# Altium schematic sheet Top.SchDoc
size A2; SheetNumber: 1; SheetTotal: 3
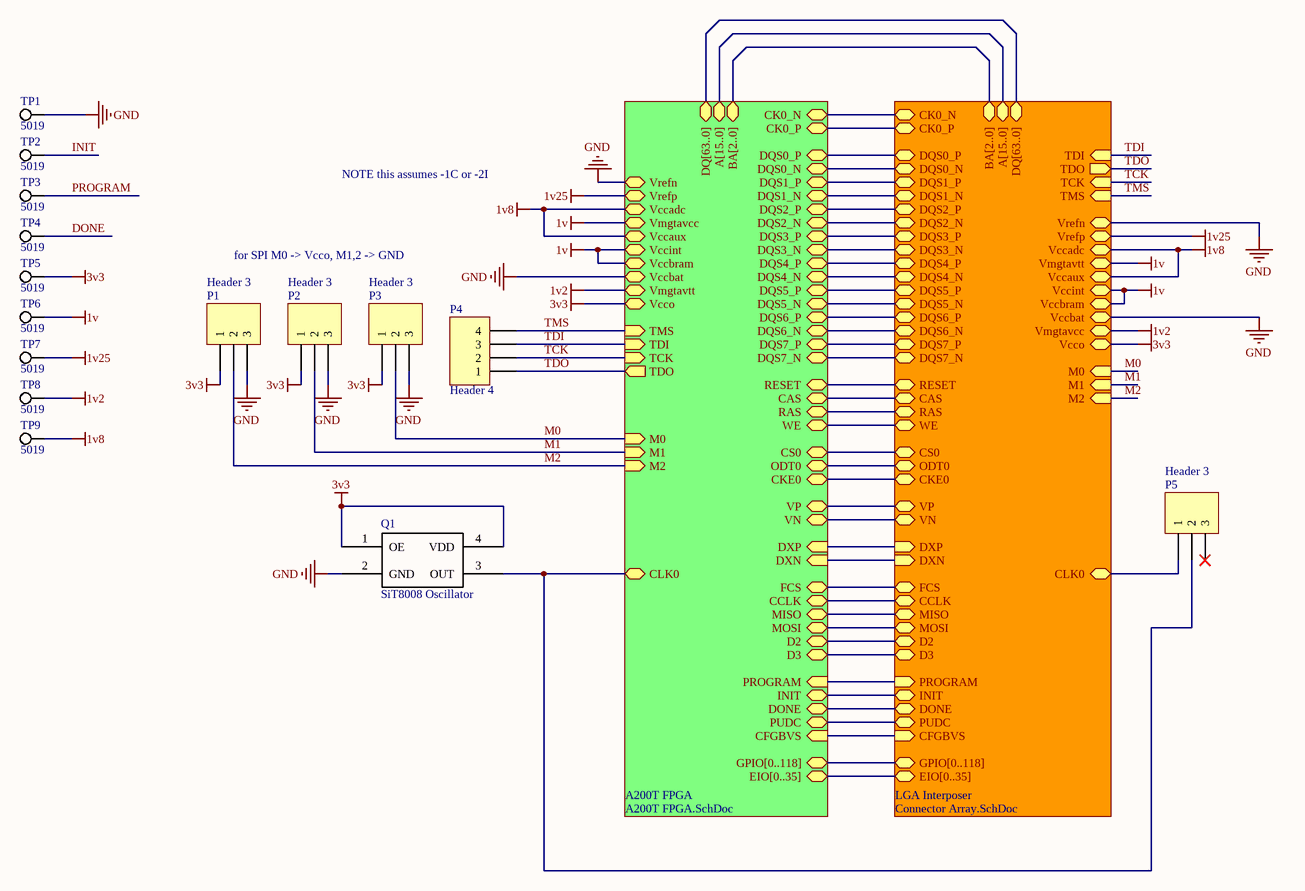
[diagram p0: Top.SchDoc]

## Parts
P1  Header 3  [HDR1X3]
P2  Header 3  [HDR1X3]
P3  Header 3  [HDR1X3]
P4  Header 4  [HDR1X4]
P5  Header 3  [HDR1X3]
Q1  SiT8008 Oscillator  [SiT8008 2.5x2]
TP1  5019  [KSTN-5019_V]
TP2  5019  [KSTN-5019_V]
TP3  5019  [KSTN-5019_V]
TP4  5019  [KSTN-5019_V]
TP5  5019  [KSTN-5019_V]
TP6  5019  [KSTN-5019_V]
TP7  5019  [KSTN-5019_V]
TP8  5019  [KSTN-5019_V]
TP9  5019  [KSTN-5019_V]

## Sub-sheets
A200T FPGA = A200T FPGA.SchDoc: BA[2..0] (bidir), A[15..0] (bidir), DQS1_P (bidir), DQS2_N (bidir), DQS7_N (bidir), DQS0_P (bidir), DQS6_N (bidir), DQS6_P (bidir), DQS1_N (bidir), DQS7_P (bidir), DQS4_P (bidir), DQS5_N (bidir), DQS3_P (bidir), DQS0_N (bidir), DQS2_P (bidir), DQS3_N (bidir), DQS4_N (bidir), DQS5_P (bidir), RAS (bidir), RESET (bidir), WE (bidir), CAS (bidir), CK0_P (bidir), CK0_N (bidir), ODT0 (bidir), CS0 (bidir), CKE0 (bidir), Vrefp (bidir), Vccadc (bidir), Vmgtavcc (bidir), Vccaux (bidir), Vccint (bidir), Vccbram (bidir), Vccbat (bidir), Vmgtavtt (bidir), Vcco (bidir), DQ[63..0] (bidir), Vrefn (bidir), PUDC (bidir), FCS (bidir), CCLK (bidir), INIT (bidir), MISO (bidir), DONE (bidir), MOSI (bidir), D2 (bidir), D3 (bidir), CLK0 (bidir), VP (bidir), VN (bidir), EIO[0..35] (bidir), GPIO[0..118] (bidir), TDO (out), CFGBVS (in), TMS (in), TCK (in), PROGRAM (in), TDI (in), DXP (in), M2 (in), M0 (in), DXN (in), M1 (in)
LGA Interposer = Connector Array.SchDoc: DQS0_P (bidir), DQS0_N (bidir), DQS1_P (bidir), DQS1_N (bidir), DQS2_P (bidir), DQS2_N (bidir), DQS3_P (bidir), DQS3_N (bidir), DQS4_P (bidir), DQS4_N (bidir), DQS5_P (bidir), DQS5_N (bidir), DQS6_P (bidir), DQS6_N (bidir), DQS7_P (bidir), DQS7_N (bidir), DQ[63..0] (bidir), A[15..0] (bidir), BA[2..0] (bidir), CK0_N (bidir), CK0_P (bidir), RAS (bidir), CAS (bidir), WE (bidir), RESET (bidir), CKE0 (bidir), ODT0 (bidir), CS0 (bidir), TDI (in), TDO (out), TCK (in), TMS (in), DXP (in), DXN (in), CLK0 (bidir), M0 (in), CCLK (bidir), M1 (in), M2 (in), DONE (bidir), INIT (bidir), PROGRAM (in), CFGBVS (in), MOSI (bidir), MISO (bidir), PUDC (bidir), FCS (bidir), D2 (bidir), D3 (bidir), Vccint (bidir), Vccaux (bidir), Vccbram (bidir), Vcco (bidir), Vccbat (bidir), Vmgtavcc (bidir), Vmgtavtt (bidir), Vccadc (bidir), Vrefp (bidir), Vrefn (bidir), EIO[0..35] (bidir), GPIO[0..118] (bidir), VP (bidir), VN (bidir)

## Nets
1v: TP6.1 ; sheet A200T FPGA/Vmgtavcc, sheet A200T FPGA/Vccint, sheet A200T FPGA/Vccbram, sheet LGA Interposer/Vccint, sheet LGA Interposer/Vccbram, sheet LGA Interposer/Vmgtavtt
1v2: TP8.1 ; sheet A200T FPGA/Vmgtavtt, sheet LGA Interposer/Vmgtavcc
1v8: TP9.1 ; sheet A200T FPGA/Vccadc, sheet A200T FPGA/Vccaux, sheet LGA Interposer/Vccaux, sheet LGA Interposer/Vccadc
1v25: TP7.1 ; sheet A200T FPGA/Vrefp, sheet LGA Interposer/Vrefp
3v3: P1.1 P2.1 P3.1 Q1.1(OE) Q1.4(VDD) TP5.1 ; sheet A200T FPGA/Vcco, sheet LGA Interposer/Vcco
GND: P1.3 P2.3 P3.3 Q1.2(GND) TP1.1 ; sheet A200T FPGA/Vccbat, sheet A200T FPGA/Vrefn, sheet LGA Interposer/Vccbat, sheet LGA Interposer/Vrefn
DONE: TP4.1
INIT: TP2.1
M0: P3.2 ; sheet A200T FPGA/M0, sheet LGA Interposer/M0
M1: P2.2 ; sheet A200T FPGA/M1, sheet LGA Interposer/M1
M2: P1.2 ; sheet A200T FPGA/M2, sheet LGA Interposer/M2
PROGRAM: TP3.1
TCK: P4.2 ; sheet A200T FPGA/TCK, sheet LGA Interposer/TCK
TDI: P4.3 ; sheet A200T FPGA/TDI, sheet LGA Interposer/TDI
TDO: P4.1 ; sheet A200T FPGA/TDO, sheet LGA Interposer/TDO
TMS: P4.4 ; sheet A200T FPGA/TMS, sheet LGA Interposer/TMS
NetP5_1: P5.1 ; sheet LGA Interposer/CLK0
NetP5_2: P5.2 Q1.3(OUT) ; sheet A200T FPGA/CLK0
(unnamed): sheet A200T FPGA/DQS1_P, sheet LGA Interposer/DQS1_P
(unnamed): sheet A200T FPGA/DQS2_N, sheet LGA Interposer/DQS2_N
(unnamed): sheet A200T FPGA/DQS7_N, sheet LGA Interposer/DQS7_N
(unnamed): sheet A200T FPGA/DQS0_P, sheet LGA Interposer/DQS0_P
(unnamed): sheet A200T FPGA/DQS6_N, sheet LGA Interposer/DQS6_N
(unnamed): sheet A200T FPGA/DQS6_P, sheet LGA Interposer/DQS6_P
(unnamed): sheet A200T FPGA/DQS1_N, sheet LGA Interposer/DQS1_N
(unnamed): sheet A200T FPGA/DQS7_P, sheet LGA Interposer/DQS7_P
(unnamed): sheet A200T FPGA/DQS4_P, sheet LGA Interposer/DQS4_P
(unnamed): sheet A200T FPGA/DQS5_N, sheet LGA Interposer/DQS5_N
(unnamed): sheet A200T FPGA/DQS3_P, sheet LGA Interposer/DQS3_P
(unnamed): sheet A200T FPGA/DQS0_N, sheet LGA Interposer/DQS0_N
(unnamed): sheet A200T FPGA/DQS2_P, sheet LGA Interposer/DQS2_P
(unnamed): sheet A200T FPGA/DQS3_N, sheet LGA Interposer/DQS3_N
(unnamed): sheet A200T FPGA/DQS4_N, sheet LGA Interposer/DQS4_N
(unnamed): sheet A200T FPGA/DQS5_P, sheet LGA Interposer/DQS5_P
(unnamed): sheet A200T FPGA/RAS, sheet LGA Interposer/RAS
(unnamed): sheet A200T FPGA/RESET, sheet LGA Interposer/RESET
(unnamed): sheet A200T FPGA/WE, sheet LGA Interposer/WE
(unnamed): sheet A200T FPGA/CAS, sheet LGA Interposer/CAS
(unnamed): sheet A200T FPGA/CK0_P, sheet LGA Interposer/CK0_P
(unnamed): sheet A200T FPGA/CK0_N, sheet LGA Interposer/CK0_N
(unnamed): sheet A200T FPGA/ODT0, sheet LGA Interposer/ODT0
(unnamed): sheet A200T FPGA/CS0, sheet LGA Interposer/CS0
(unnamed): sheet A200T FPGA/CKE0, sheet LGA Interposer/CKE0
(unnamed): sheet A200T FPGA/PUDC, sheet LGA Interposer/PUDC
(unnamed): sheet A200T FPGA/FCS, sheet LGA Interposer/FCS
(unnamed): sheet A200T FPGA/CCLK, sheet LGA Interposer/CCLK
(unnamed): sheet A200T FPGA/INIT, sheet LGA Interposer/INIT
(unnamed): sheet A200T FPGA/MISO, sheet LGA Interposer/MISO
(unnamed): sheet A200T FPGA/DONE, sheet LGA Interposer/DONE
(unnamed): sheet A200T FPGA/MOSI, sheet LGA Interposer/MOSI
(unnamed): sheet A200T FPGA/D2, sheet LGA Interposer/D2
(unnamed): sheet A200T FPGA/D3, sheet LGA Interposer/D3
(unnamed): sheet A200T FPGA/VP, sheet LGA Interposer/VP
(unnamed): sheet A200T FPGA/VN, sheet LGA Interposer/VN
(unnamed): sheet A200T FPGA/CFGBVS, sheet LGA Interposer/CFGBVS
(unnamed): sheet A200T FPGA/PROGRAM, sheet LGA Interposer/PROGRAM
(unnamed): sheet A200T FPGA/DXP, sheet LGA Interposer/DXP
(unnamed): sheet A200T FPGA/DXN, sheet LGA Interposer/DXN

Not connected (* = marked no-connect by the designer): P5 3*

## Buses and harness runs
bus sheet A200T FPGA/A[15..0] = sheet LGA Interposer/A[15..0]
bus sheet A200T FPGA/BA[2..0] = sheet LGA Interposer/BA[2..0]
bus sheet A200T FPGA/DQ[63..0] = sheet LGA Interposer/DQ[63..0]
bus sheet A200T FPGA/EIO[0..35] = sheet LGA Interposer/EIO[0..35]
bus sheet A200T FPGA/GPIO[0..118] = sheet LGA Interposer/GPIO[0..118]

## Notes on the sheet
- NOTE this assumes -1C or -2I
- for SPI M0 -> Vcco, M1,2 -> GND

## Library data of the parts
P1-P3 P5 = Header 3: Header, 3-Pin; LatestRevisionDate: 17-Jul-2002; LatestRevisionNote: Re-released for DXP Platform.; Publisher: Altium Limited
P4 = Header 4: Header, 4-Pin; LatestRevisionDate: 17-Jul-2002; LatestRevisionNote: Re-released for DXP Platform.; Publisher: Altium Limited
TP1-TP9 = CMP-1672-00008-1: Test Point, 1 Position SMD, RoHS, Tape and Reel; ComponentLink1Description: Manufacturer URL; Package Quantity: 1000; DatasheetVersion: 03/2014; Packaging: Tape and Reel; ComponentLink2URL: http://www.keyelco.com/product-pdf.cfm?p=1357; ComponentLink1URL: http://www.keyelco.com/; Mount: Surface Mount; Contact Plating: Silver; PackageDescription: 1-Pin Surface Mount Device, Body 3.81 x 2.03 mm; Pins: 1; RoHSCompliant: True; Mounting Technology: Surface Mount; ComponentLink2Description: Datasheet; PackageReference: 5019